# EAGLE design Teensy SD with Amp (EAGLE 8.2.2)
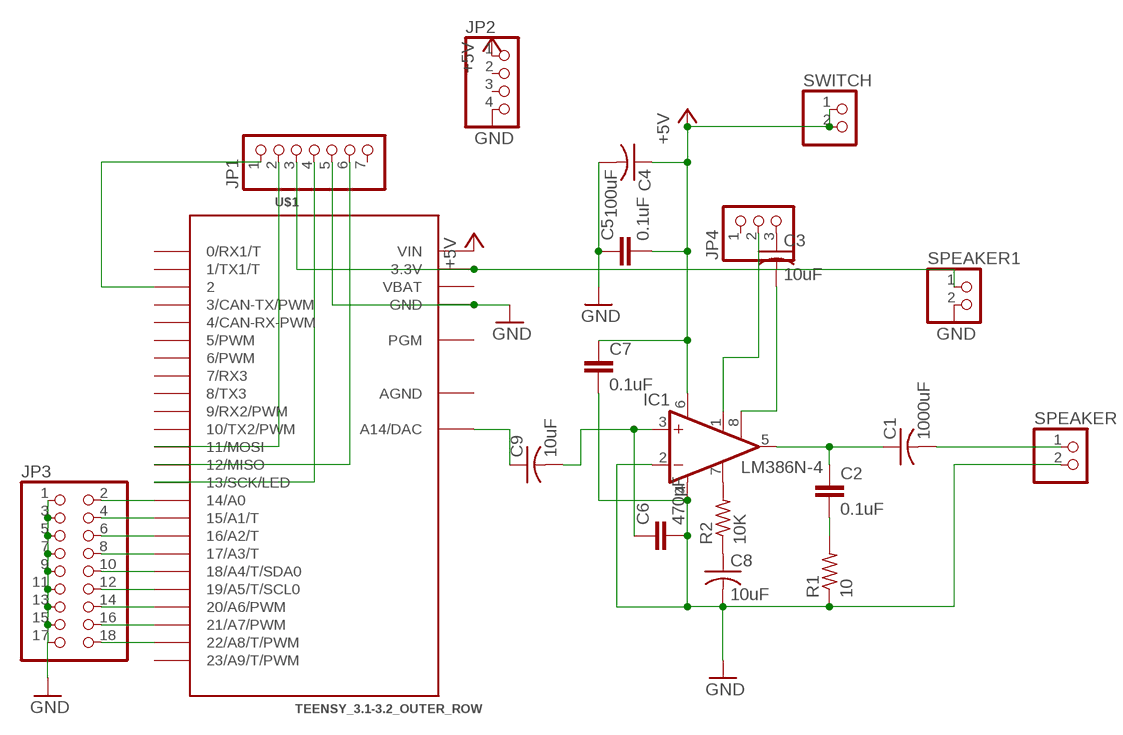
[diagram p0: schematic, sheet 1]

## Parts
C1  1000uF  C-US025-030X050  [C025-030X050]
C2  0.1uF  C2.5/4  [C2.5-4]
C3  10uF  C-US025-030X050  [C025-030X050]
C4  100uF  C-US025-030X050  [C025-030X050]
C5  0.1uF  C2.5/4  [C2.5-4]
C6  470pF  C2.5/4  [C2.5-4]
C7  0.1uF  C2.5/4  [C2.5-4]
C8  10uF  C-US025-030X050  [C025-030X050]
C9  10uF  C-US025-030X050  [C025-030X050]
IC1  LM386N-4  [DIL08]
JP1  PINHD-1X7  [1X07]
JP2  PINHD-1X4  [1X04]
JP3  PINHD-2X9  [2X09]
JP4  PINHD-1X3  [1X03]
R1  10  R-US_0207/7  [0207/7]
R2  10K  R-US_0207/7  [0207/7]
SPEAKER  PINHD-1X2  [1X02]
SPEAKER1  PINHD-1X2  [1X02]
SWITCH  PINHD-1X2  [1X02]
U$1  TEENSY_3.1-3.2_OUTER_ROW  [TEENSY_3.0-3.2&LC_OUTER_ROW]

## Nets
+5V: C4.1 C5.2 C7.1 IC1.6(VS) JP2.1 SWITCH.1 SWITCH.2 U$1.VIN
GND: C4.2 C5.1 C6.2 C7.2 C8.2 IC1.2(-IN) IC1.4(GND) JP1.5 JP2.4 JP3.1 JP3.3 JP3.5 JP3.7 JP3.9 JP3.11 JP3.13 JP3.15 JP3.17 R1.1 SPEAKER1.2 SPEAKER.2 U$1.GND U$1.GND1(GND)
N$1: C3.1 JP4.3
N$2: C3.2 IC1.8(GAIN)
N$3: C1.1 C2.1 IC1.5(OUT)
N$4: IC1.7(BYPASS) R2.2
N$5: C8.1 R2.1
N$6: C6.1 C9.2 IC1.3(+IN)
N$7: C2.2 R1.2
N$8: JP1.3 SPEAKER1.1 U$1.3.3V U$1.3.3V1(3.3V)
N$9: C1.2 SPEAKER.1
N$10: JP3.18 U$1.22/A8(22/A8/T/PWM)
N$11: JP1.4 U$1.13(13/SCK/LED)
N$12: JP1.2 U$1.11(11/MOSI)
N$13: JP1.6 U$1.12(12/MISO)
N$14: JP3.16 U$1.21/A7(21/A7/PWM)
N$15: JP3.14 U$1.20/A6(20/A6/PWM)
N$16: JP3.12 U$1.19/A5(19/A5/T/SCL0)
N$17: JP3.10 U$1.18/A4(18/A4/T/SDA0)
N$18: JP3.8 U$1.17/A3(17/A3/T)
N$19: JP3.6 U$1.16/A2(16/A2/T)
N$20: JP3.4 U$1.15/A1(15/A1/T)
N$21: JP3.2 U$1.14/A0
N$22: C9.1 U$1.RESET/DAC(A14/DAC)
N$26: IC1.1(GAIN) JP4.2
N$27: JP1.1 U$1.2
Unconnected: JP1.7 JP2.2 JP2.3 JP4.1 U$1.0(0/RX1/T) U$1.1(1/TX1/T) U$1.3(3/CAN-TX/PWM) U$1.4(4/CAN-RX-PWM) U$1.5(5/PWM) U$1.6(6/PWM) U$1.7(7/RX3) U$1.8(8/TX3) U$1.9(9/RX2/PWM) U$1.10(10/TX2/PWM) U$1.23/A9(23/A9/T/PWM) U$1.PGM

## Power pins joined to a net without a drawn wire
AGND: U$1.AGND
VBAT: U$1.VBAT

## Library data of the parts
C1 C3 C4 C8 C9 = rcl:C-US: CAPACITOR, American symbol
C2 C5-C7 = capacitor-wima:C: CAPACITOR naming: grid - package width
IC1 = linear:LM386?-*: Low Voltage Audio Power Amplifier Source: http://cache.national.com/ds/LM/LM386.pdf
JP1 = pinhead:PINHD-1X7: PIN HEADER
JP2 = pinhead:PINHD-1X4: PIN HEADER
JP3 = pinhead:PINHD-2X9: PIN HEADER
JP4 = pinhead:PINHD-1X3: PIN HEADER
R1 R2 = resistor:R-US_: RESISTOR, American symbol
SPEAKER SPEAKER1 SWITCH = pinhead:PINHD-1X2: PIN HEADER
U$1 = Teensy_3_and_LC_Series_Boards_v1.4:TEENSY_3.1-3.2_OUTER_ROW: Footprint for Teensy 3.1 or 3.2 board using all pin connections on the outer perimeter

## Board
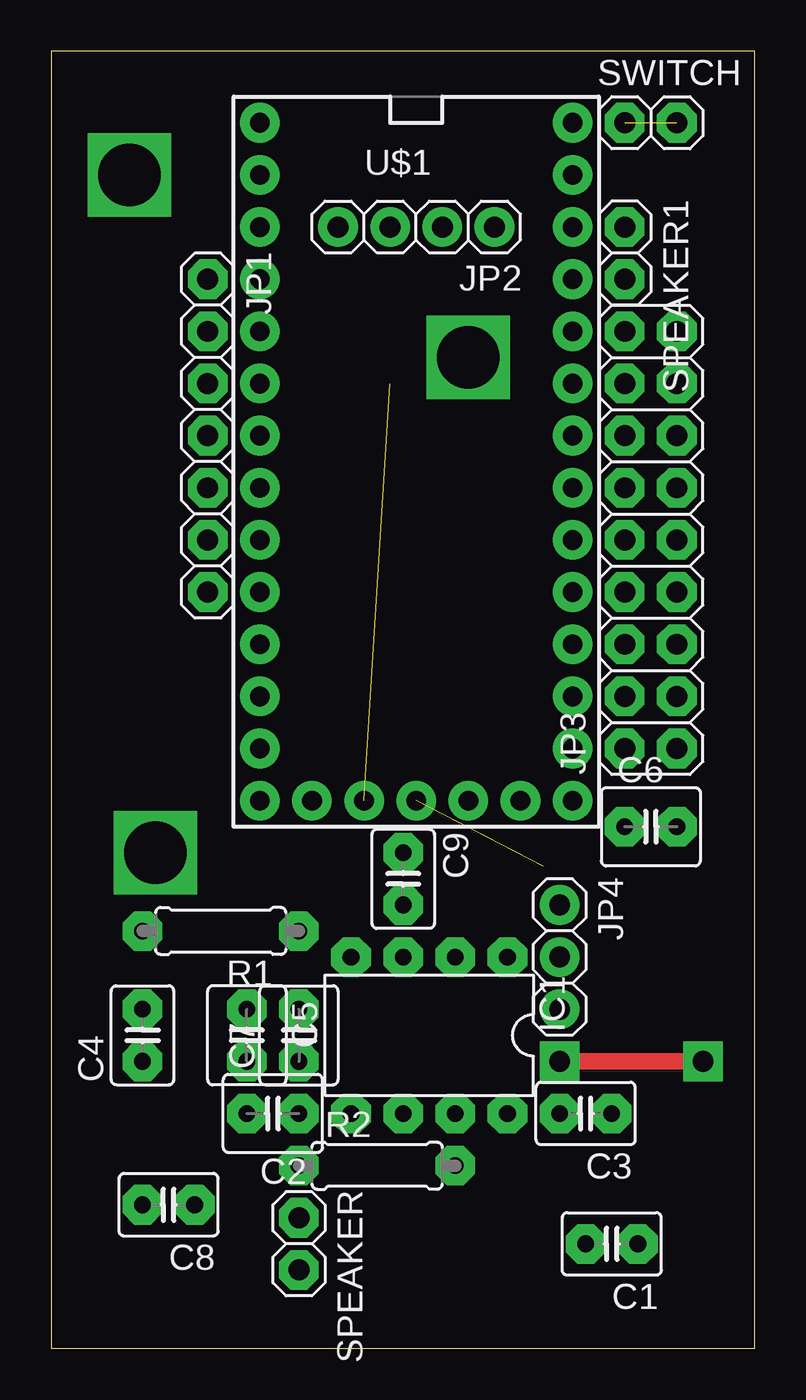
[diagram p1: board, top side]
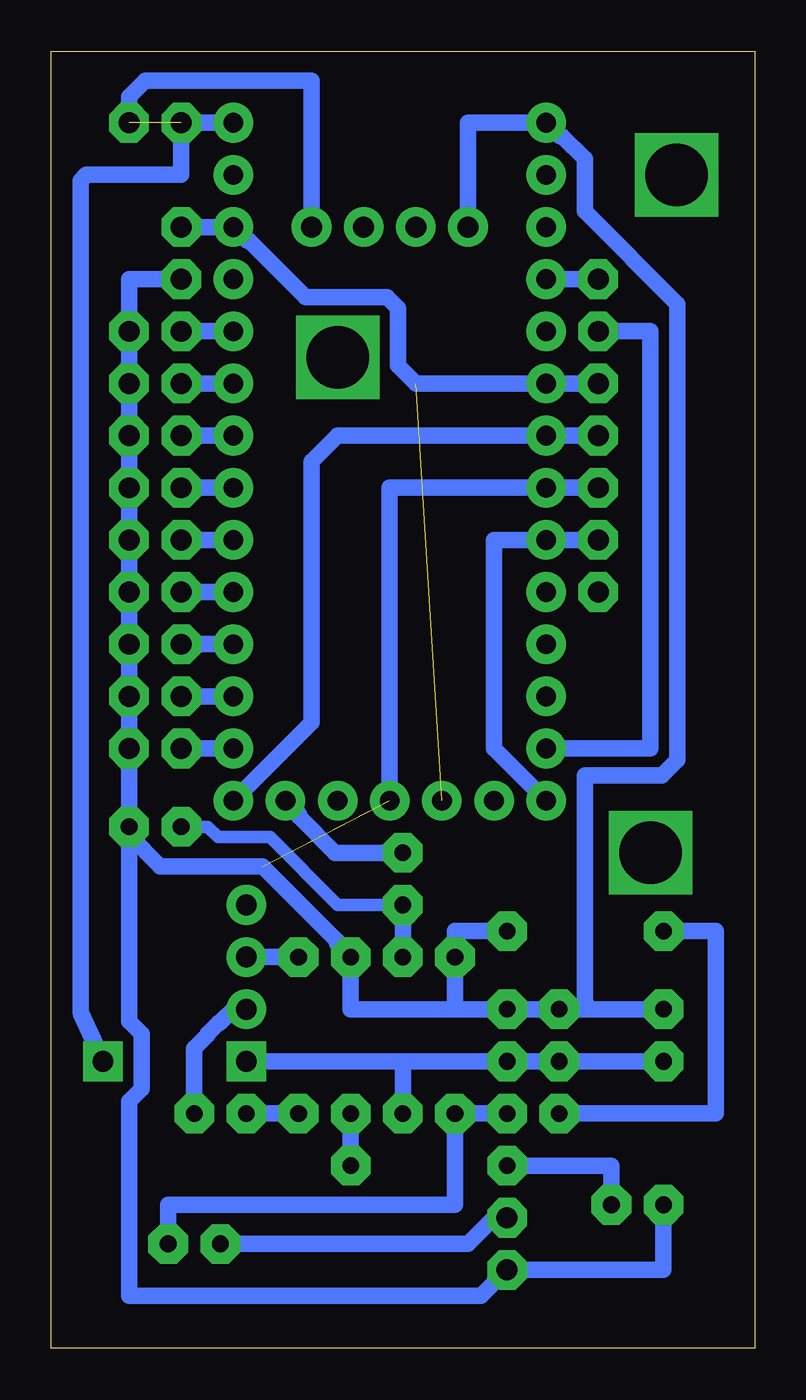
[diagram p2: board, bottom side, seen from below]

Size 34.27 x 63.17 mm. Coordinates in mm from the lower left corner, seen from the top.
Outline: 0,0 34.27,0 34.27,63.17 0,63.17 0,0
Copper layers (1*16): Top 0.035mm / dielectric 1.5mm / Bottom 0.035mm
Design rules "default *": minimum track width 10mil, minimum drill 24mil, track to track 16mil, track to pad 16mil, pad to pad 16mil, via to via 16mil, smd to smd 16mil, copper to edge 40mil, drill to drill 8mil, minimum pad ring 10mil, minimum via ring 8mil, stop-mask expansion 4mil, vias tented up to drill 0mil, thermal gap 10mil

### Footprints (pad centres in the part's own frame; a part is rotated, then mirrored left to right if it is on the bottom)
C025-030X050 = drill 0.813 pad 1.93 octagon: 1 -1.27,0; 2 1.27,0
C2.5-4 = drill 0.813 pad 1.93 octagon: 1 -1.27,0; 2 1.27,0
DIL08 = drill 0.813 pad 1.93 octagon: 1 -3.81,-3.81; 2 -1.27,-3.81; 3 1.27,-3.81; 4 3.81,-3.81; 5 3.81,3.81; 6 1.27,3.81; 7 -1.27,3.81; 8 -3.81,3.81
1X07 = drill 1.016 pad 1.93 octagon: 1 -7.62,0; 2 -5.08,0; 3 -2.54,0; 4 0,0; 5 2.54,0; 6 5.08,0; 7 7.62,0
1X04 = drill 1.016 pad 1.93: 1 -3.81,0; 2 -1.27,0; 3 1.27,0; 4 3.81,0
2X09 = drill 1.016 pad 1.93 octagon: 1 -10.16,-1.27; 2 -10.16,1.27; 3 -7.62,-1.27; 4 -7.62,1.27; 5 -5.08,-1.27; 6 -5.08,1.27; 7 -2.54,-1.27; 8 -2.54,1.27; 9 0,-1.27; 10 0,1.27; 11 2.54,-1.27; 12 2.54,1.27; 13 5.08,-1.27; 14 5.08,1.27; 15 7.62,-1.27; 16 7.62,1.27; 17 10.16,-1.27; 18 10.16,1.27
1X03 = drill 1.016 pad 1.93: 1 -2.54,0; 2 0,0; 3 2.54,0
0207/7 = drill 0.813 pad 1.93 octagon: 1 -3.81,0; 2 3.81,0
1X02 = drill 1.016 pad 1.93 octagon: 1 -1.27,0; 2 1.27,0
TEENSY_3.0-3.2&LC_OUTER_ROW = drill 0.965 pad 1.93: 0 -7.62,13.97; 1 -7.62,11.43; 2 -7.62,8.89; 3 -7.62,6.35; 3.3V 7.62,11.43; 3.3V1 -2.54,-16.51; 4 -7.62,3.81; 5 -7.62,1.27; 6 -7.62,-1.27; 7 -7.62,-3.81; 8 -7.62,-6.35; 9 -7.62,-8.89; 10 -7.62,-11.43; 11 -7.62,-13.97; 12 -7.62,-16.51; 13 7.62,-16.51; 14/A0 7.62,-13.97; 15/A1 7.62,-11.43; 16/A2 7.62,-8.89; 17/A3 7.62,-6.35; 18/A4 7.62,-3.81; 19/A5 7.62,-1.27; 20/A6 7.62,1.27; 21/A7 7.62,3.81; 22/A8 7.62,6.35; 23/A9 7.62,8.89; AGND 7.62,13.97; GND -7.62,16.51; GND1 0,-16.51; PGM 2.54,-16.51; RESET/DAC 5.08,-16.51; VBAT -5.08,-16.51; VIN 7.62,16.51

### Placement (x,y rotation side)
C1  27.3,5.08 180 top
C2  10.79,11.43 180 top
C3  26.04,11.43 180 top
C4  4.45,15.24 90 top
C5  9.53,15.24 270 top
C6  29.21,25.4 0 top
C7  12.06,15.24 90 top
C8  5.71,6.99 180 top
C9  17.14,22.86 270 top
IC1  18.41,15.24 180 top
JP1  7.62,44.45 270 top
JP2  17.78,54.61 180 top
JP3  29.21,39.37 90 top
JP4  24.77,19.05 270 top
R1  8.26,20.32 180 top
R2  15.88,8.89 0 top
SPEAKER  12.06,5.08 270 top
SPEAKER1  27.94,53.34 270 top
SWITCH  29.21,59.69 0 top
U$1  17.78,43.18 0 top

### Tracks (layer width: path | path; a pad name or v marks a point on that pad's centre or on a via)
+5V  (via drill 1 pad 1.93)  (1 unrouted)
  Top 0.813: v24.77,13.97 v31.75,13.97
  Bottom 0.813: 17.14,13.97 C7.1 C5.2 C4.1 | 17.14,13.97 IC1.6 | v31.75,13.97 32.85,16.34 32.85,56.87 32.57,57.15 27.94,57.15 SWITCH.1 U$1.VIN | v24.77,13.97 17.14,13.97 | SWITCH.2 30.48,60.96 29.69,61.75 21.59,61.75 JP2.1
GND  (1 unrouted)
  Bottom 0.813: JP1.5 17.78,41.91 U$1.GND1 | R1.1 14.61,20.32 IC1.4 14.61,16.51 | 14.61,16.51 C7.2 C5.1 7.96,16.51 | 14.61,16.51 19.68,16.51 IC1.2 20.34,19.71 20.34,19.83 23.99,23.47 28.95,23.47 30.48,24.99 | C8.2 4.45,3.81 SPEAKER.2 13.34,2.54 30.48,2.54 30.48,12.02 29.87,12.63 29.87,15.31 30.48,15.92 30.48,24.99 | 30.48,24.99 C6.2 JP3.1 JP3.3 JP3.5 JP3.7 JP3.9 JP3.11 JP3.13 JP3.15 JP3.17 30.48,52.07 SPEAKER1.2 | 7.96,16.51 C4.2 | 7.96,16.51 8.28,16.83 8.28,27.89 4.53,27.89 3.76,28.66 3.76,50.87 8.28,55.39 8.28,57.93 9.38,59.03 9.5,59.03 U$1.GND 13.97,59.69 JP2.4
N$1
  Bottom 0.813: C3.1 27.3,14.61 26.64,15.27 26.64,15.31 26.11,15.85 26.06,15.85 25.4,16.51 JP4.3
N$2
  Bottom 0.813: IC1.8 C3.2
N$3
  Bottom 0.813: C2.1 IC1.5 14.61,6.99 28.57,6.99 C1.1
N$4
  Bottom 0.813: IC1.7 R2.2
N$5
  Bottom 0.813: R2.1 6.99,8.89 C8.1
N$6
  Bottom 0.61: C6.1 26.64,25.4 26.14,24.89 23.62,24.89 20.32,21.59 C9.2
  Bottom 0.813: C9.2 IC1.3
N$7
  Bottom 0.813: R1.2 1.91,20.32 1.91,11.43 C2.2
N$8  (1 unrouted)
  Bottom 0.813: JP1.3 16.51,46.99 17.37,47.85 17.37,50.67 17.91,51.21 21.88,51.21 24.62,53.95 24.74,53.95 U$1.3.3V SPEAKER1.1
N$9
  Bottom 0.813: C1.2 13.97,5.08 12.7,6.35 SPEAKER.1
N$10
  Bottom 0.813: U$1.22/A8 JP3.18
N$11
  Bottom 0.813: JP1.4 20.32,44.45 21.59,43.18 21.59,30.48 U$1.13
N$12
  Bottom 0.813: JP1.2 5.08,49.53 5.08,29.21 U$1.11
N$13
  Bottom 0.813: JP1.6 12.7,39.37 12.7,29.21 U$1.12
N$14
  Bottom 0.813: U$1.21/A7 JP3.16
N$15
  Bottom 0.813: U$1.20/A6 JP3.14
N$16
  Bottom 0.813: U$1.19/A5 JP3.12
N$17
  Bottom 0.813: U$1.18/A4 JP3.10
N$18
  Bottom 0.813: U$1.17/A3 JP3.8
N$19
  Bottom 0.813: U$1.16/A2 JP3.6
N$20
  Bottom 0.813: U$1.15/A1 JP3.4
N$21
  Bottom 0.813: U$1.14/A0 JP3.2
N$22
  Bottom 0.813: U$1.RESET/DAC 22.2,26.01 22.2,25.89 20.44,24.13 C9.1
N$23  (via drill 3.05)
  other vias: 3.81,57.15
N$24  (via drill 3.05)
  other vias: 20.32,48.26
N$25  (via drill 3.05)
  other vias: 5.08,24.13
N$26
  Bottom 0.813: IC1.1 JP4.2
N$27
  Bottom 0.813: JP1.1 U$1.2